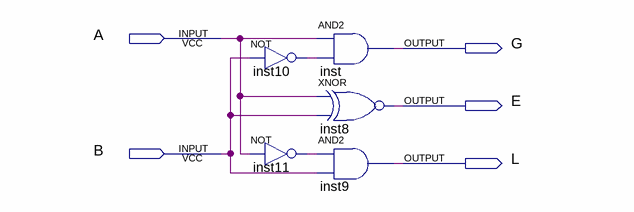
[diagram p0: schematic sheet]
// Quartus schematic 1bit_compare.bdf as structural Verilog: 5 symbols, 5 pins
module \1bit_compare  (
  input  A,
  input  B,
  output G,
  output E,
  output L
);

  wire inst10_out, inst11_out;

  not inst10 (inst10_out, B);
  not inst11 (inst11_out, A);
  and inst (G, A, inst10_out);
  xnor inst8 (E, A, B);
  and inst9 (L, inst11_out, B);
endmodule
